# EAGLE design PitotCTRLboard (EAGLE 9.6.2)
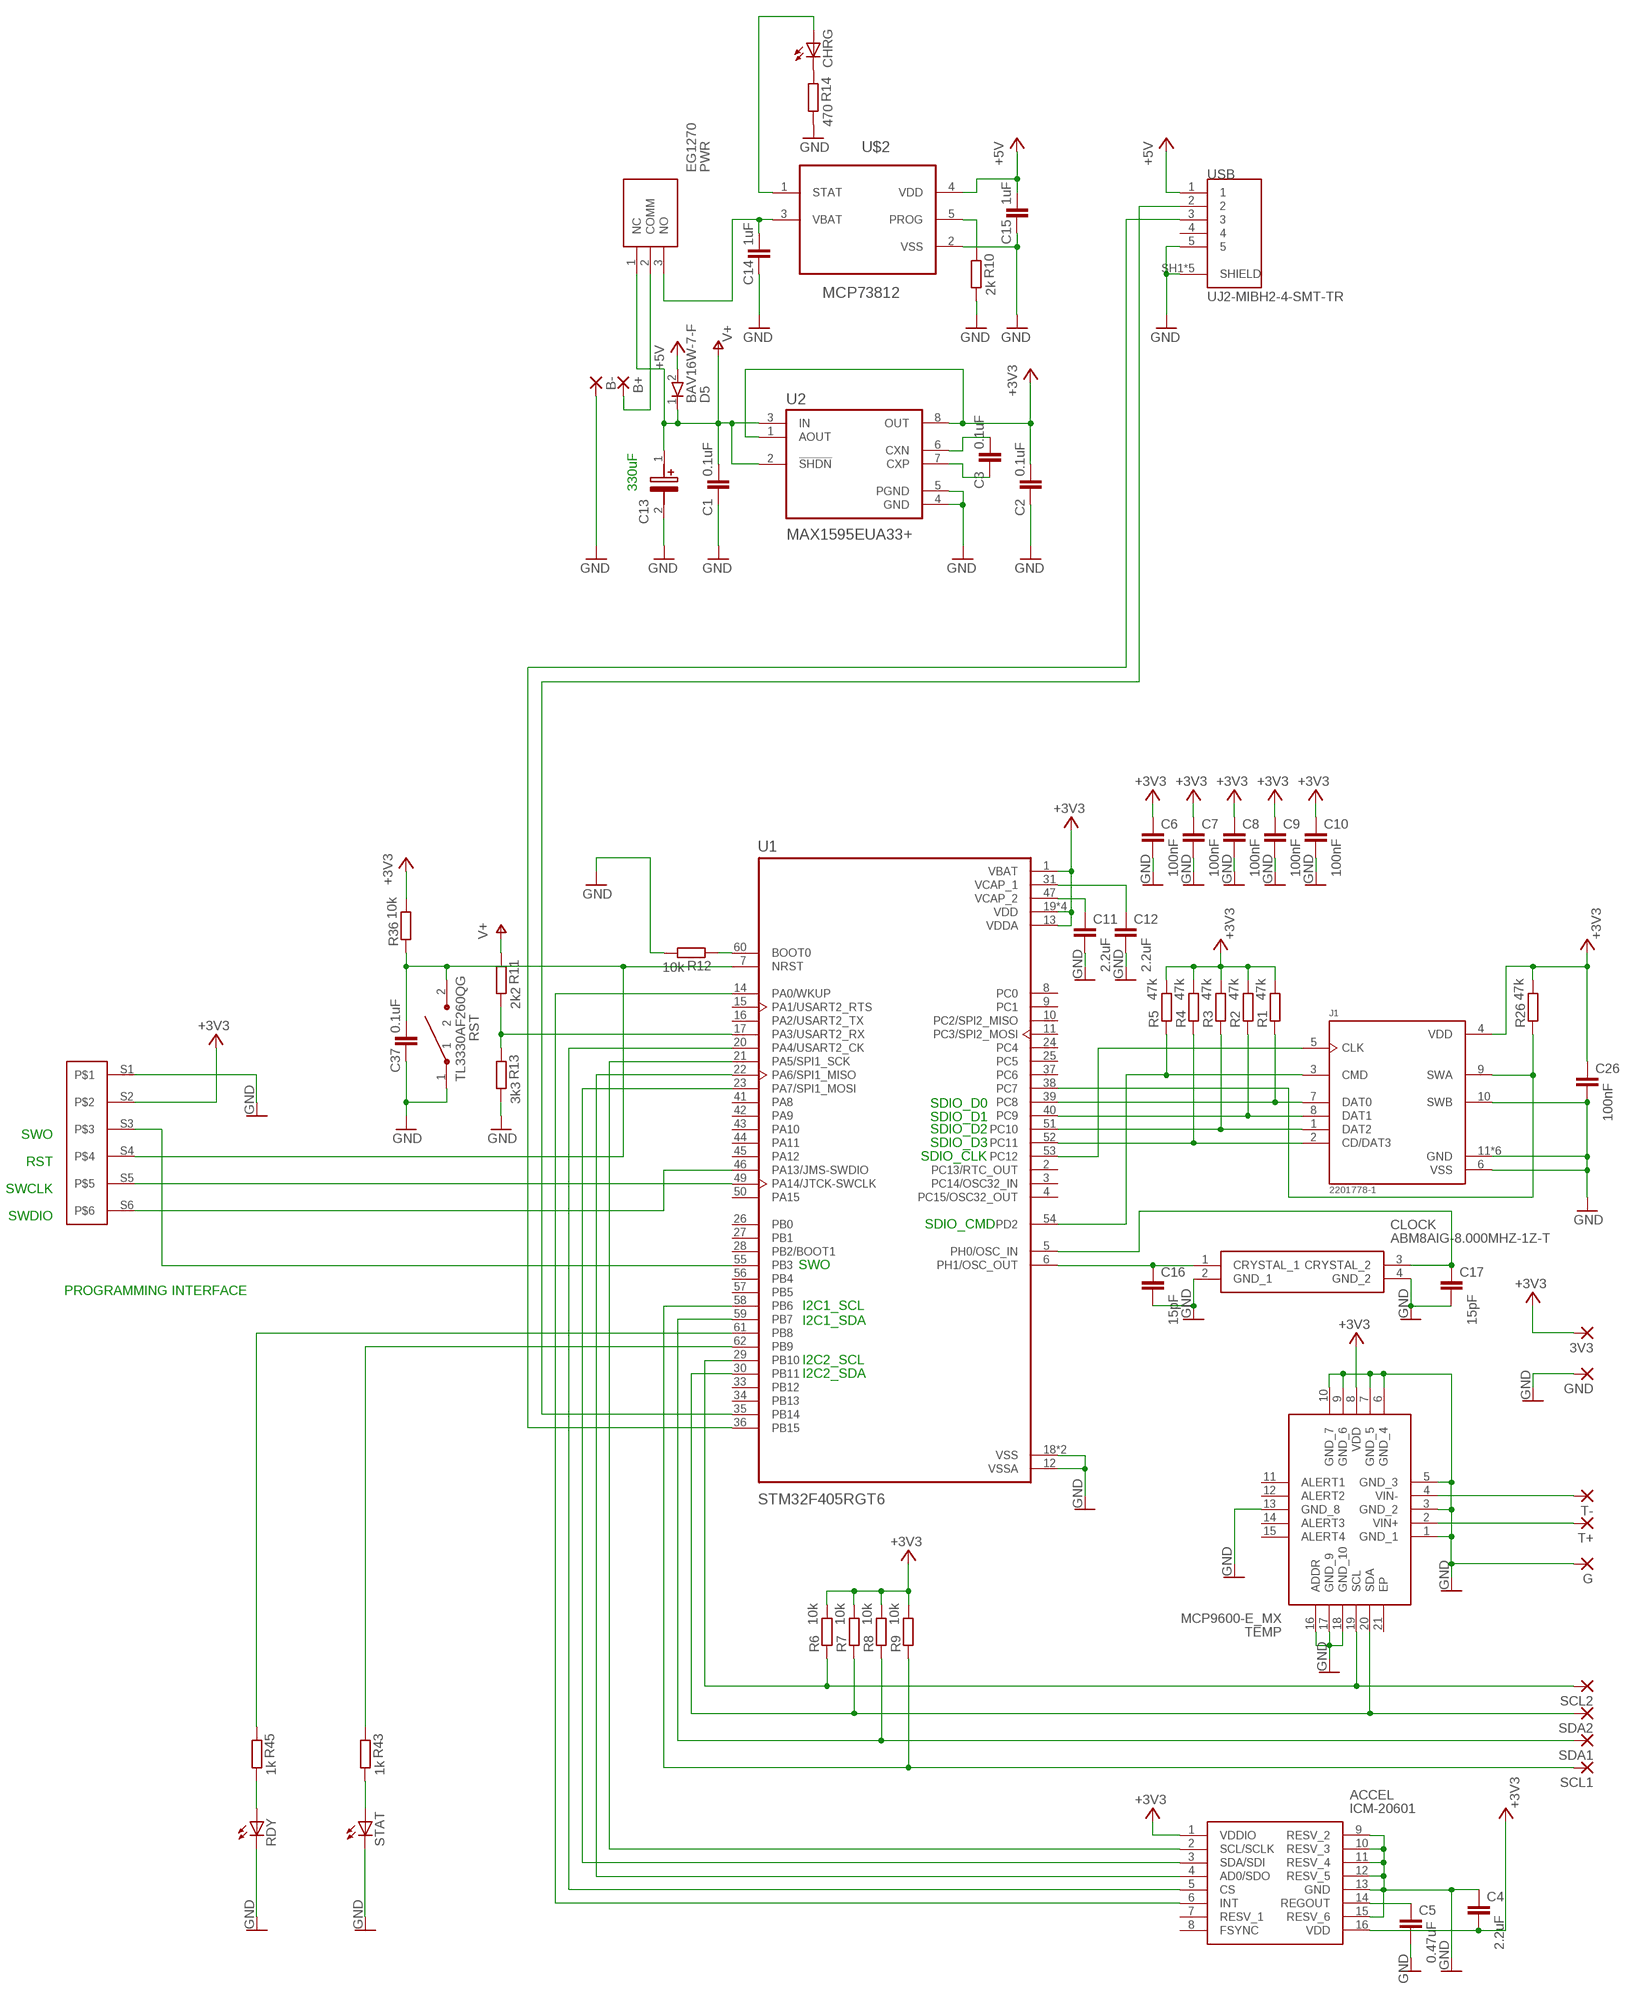
[diagram p0: schematic, sheet 1]

## Parts
3V3  SMD2  [SMD1,27-2,54]
ACCEL  ICM-20601  [PULL-BACK-QFN-16]
B+  1,6/0,9  [1,6/0,9]
B-  1,6/0,9  [1,6/0,9]
C1  0.1uF  C-EUC0603K  [C0603K]
C2  0.1uF  C-EUC0603K  [C0603K]
C3  0.1uF  C-EUC0603K  [C0603K]
C4  2.2uF  C-EUC0603K  [C0603K]
C5  0.47uF  C-EUC0603K  [C0603K]
C6  100nF  C-EUC0603K  [C0603K]
C7  100nF  C-EUC0603K  [C0603K]
C8  100nF  C-EUC0603K  [C0603K]
C9  100nF  C-EUC0603K  [C0603K]
C10  100nF  C-EUC0603K  [C0603K]
C11  2.2uF  C-EUC0603K  [C0603K]
C12  2.2uF  C-EUC0603K  [C0603K]
C13  330uF  T491C106K035AT  [CAPPM6032X280N]
C14  1uF  C-EUC0603K  [C0603K]
C15  1uF  C-EUC0603K  [C0603K]
C16  15pF  C-EUC0603K  [C0603K]
C17  15pF  C-EUC0603K  [C0603K]
C26  100nF  C-EUC0603K  [C0603K]
C37  0.1uF  C-EUC0603K  [C0603K]
CHRG  LEDCHIPLED_0805  [CHIPLED_0805]
CLOCK  ABM8AIG-8.000MHZ-1Z-T  [ABM8AIG8000MHZ1ZT]
D5  BAV16W-7-F  [SOD3716X145N]
G  1,6/0,9  [1,6/0,9]
GND  SMD2  [SMD1,27-2,54]
J1  2201778-1  [TE_2201778-1]
PWR  EG1270  [EG1270]
R1  47k  R-EU_R0603  [R0603]
R2  47k  R-EU_R0603  [R0603]
R3  47k  R-EU_R0603  [R0603]
R4  47k  R-EU_R0603  [R0603]
R5  47k  R-EU_R0603  [R0603]
R6  10k  R-EU_R0603  [R0603]
R7  10k  R-EU_R0603  [R0603]
R8  10k  R-EU_R0603  [R0603]
R9  10k  R-EU_R0603  [R0603]
R10  2k  R-EU_R0603  [R0603]
R11  2k2  R-EU_R0603  [R0603]
R12  10k  R-EU_R0603  [R0603]
R13  3k3  R-EU_R0603  [R0603]
R14  470  R-EU_R0603  [R0603]
R26  47k  R-EU_R0603  [R0603]
R36  10k  R-EU_R0603  [R0603]
R43  1k  R-EU_R0603  [R0603]
R45  1k  R-EU_R0603  [R0603]
RDY  LEDCHIPLED_0805  [CHIPLED_0805]
RST  TL3330AF260QG  [TL3330]
SCL1  1,6/0,9  [1,6/0,9]
SCL2  1,6/0,9  [1,6/0,9]
SDA1  1,6/0,9  [1,6/0,9]
SDA2  1,6/0,9  [1,6/0,9]
STAT  LEDCHIPLED_0805  [CHIPLED_0805]
T+  1,6/0,9  [1,6/0,9]
T-  1,6/0,9  [1,6/0,9]
TEMP  MCP9600-E_MX  [QFN65P500X500X100-21N]
U1  STM32F405RGT6  [QFP50P1200X1200X160-64N]
U2  MAX1595EUA33+  [SOP65P490X110-8N]
U$1  DEBUG  [DEBUG]
U$2  MCP73812  MCP73831T-2ACI/OT  [SOT95P280X145-5N]
USB  UJ2-MIBH2-4-SMT-TR  [CUI_UJ2-MIBH2-4-SMT-TR]

## Nets
+3V3: 3V3.1(P) ACCEL.1(VDDIO) ACCEL.16(VDD) C2.1 C4.2 C6.1 C7.1 C8.1 C9.1 C10.1 C26.1 J1.4(VDD) R1.2 R2.2 R3.2 R4.2 R5.2 R6.2 R7.2 R8.2 R9.2 R26.2 R36.2 TEMP.8(VDD) U1.1(VBAT) U1.13(VDDA) U1.19(VDD) U1.32(VDD) U1.48(VDD) U1.64(VDD) U2.1(AOUT) U2.8(OUT) U$1.S2
+5V: C15.1 D5.2(A) U$2.4(VDD) USB.1
GND: ACCEL.9(RESV_2) ACCEL.10(RESV_3) ACCEL.11(RESV_4) ACCEL.12(RESV_5) ACCEL.13(GND) ACCEL.15(RESV_6) B-.1(P) C1.2 C2.2 C4.1 C5.2 C6.2 C7.2 C8.2 C9.2 C10.2 C11.2 C12.2 C13.2(-) C14.2 C15.2 C16.2 C17.2 C26.2 C37.2 CLOCK.2(GND_1) CLOCK.4(GND_2) G.1(P) GND.1(P) J1.6(VSS) J1.10(SWB) J1.11(GND) J1.12(GND) J1.13(GND) J1.14(GND) J1.15(GND) J1.16(GND) R10.2 R12.2 R13.2 R14.2 RDY.C RST.1 STAT.C TEMP.1(GND_1) TEMP.3(GND_2) TEMP.5(GND_3) TEMP.6(GND_4) TEMP.7(GND_5) TEMP.9(GND_6) TEMP.10(GND_7) TEMP.13(GND_8) TEMP.16(ADDR) TEMP.17(GND_9) TEMP.18(GND_10) U1.12(VSSA) U1.18(VSS) U1.63(VSS) U2.4(GND) U2.5(PGND) U$1.S1 U$2.2(VSS) USB.5 USB.SH1(SHIELD) USB.SH2(SHIELD) USB.SH3(SHIELD) USB.SH4(SHIELD) USB.SH5(SHIELD)
N$1: T-.1(P) TEMP.4(VIN-)
N$2: T+.1(P) TEMP.2(VIN+)
N$3: R8.1 SDA1.1(P) U1.59(PB7)
N$4: R9.1 SCL1.1(P) U1.58(PB6)
N$5: J1.7(DAT0) R1.1 U1.39(PC8)
N$6: J1.8(DAT1) R2.1 U1.40(PC9)
N$7: J1.1(DAT2) R3.1 U1.51(PC10)
N$8: J1.2(CD/DAT3) R4.1 U1.52(PC11)
N$9: J1.3(CMD) R5.1 U1.54(PD2)
N$10: R6.1 SCL2.1(P) TEMP.19(SCL) U1.29(PB10)
N$11: R7.1 SDA2.1(P) TEMP.20(SDA) U1.30(PB11)
N$12: ACCEL.2(SCL/SCLK) U1.21(PA5/SPI1_SCK)
N$13: U1.46(PA13/JMS-SWDIO) U$1.S6
N$14: ACCEL.4(AD0/SDO) U1.22(PA6/SPI1_MISO)
N$15: ACCEL.3(SDA/SDI) U1.23(PA7/SPI1_MOSI)
N$16: U1.49(PA14/JTCK-SWCLK) U$1.S5
N$17: ACCEL.5(CS) U1.20(PA4/USART2_CK)
N$18: J1.5(CLK) U1.53(PC12)
N$19: R12.1 U1.60(BOOT0)
N$20: R43.2 STAT.A
N$21: R43.1 U1.62(PB9)
N$22: R45.1 U1.61(PB8)
N$23: C17.1 CLOCK.3(CRYSTAL_2) U1.5(PH0/OSC_IN)
N$24: B+.1(P) PWR.2(COMM)
N$25: C3.1 U2.6(CXN)
N$26: C3.2 U2.7(CXP)
N$31: ACCEL.14(REGOUT) C5.1
N$32: U1.35(PB14) USB.2
N$33: C12.1 U1.31(VCAP_1)
N$34: C11.1 U1.47(VCAP_2)
N$35: U1.36(PB15) USB.3
N$36: R10.1 U$2.5(PROG)
N$37: R11.2 R13.1 U1.17(PA3/USART2_RX)
N$38: C14.1 PWR.3(NO) U$2.3(VBAT)
N$39: C16.1 CLOCK.1(CRYSTAL_1) U1.6(PH1/OSC_OUT)
N$40: CHRG.A U$2.1(STAT)
N$41: CHRG.C R14.1
N$42: ACCEL.6(INT) U1.14(PA0/WKUP)
N$50: C37.1 R36.1 RST.2 U1.7(NRST) U$1.S4
N$51: R45.2 RDY.A
N$71: J1.9(SWA) R26.1 U1.38(PC7)
N$93: U1.55(PB3) U$1.S3
V+: C1.1 C13.1(+) D5.1(K) PWR.1(NC) R11.1 U2.2(!SHDN) U2.3(IN)
Unconnected: ACCEL.7(RESV_1) ACCEL.8(FSYNC) TEMP.11(ALERT1) TEMP.12(ALERT2) TEMP.14(ALERT3) TEMP.15(ALERT4) TEMP.21(EP) U1.2(PC13/RTC_OUT) U1.3(PC14/OSC32_IN) U1.4(PC15/OSC32_OUT) U1.8(PC0) U1.9(PC1) U1.10(PC2/SPI2_MISO) U1.11(PC3/SPI2_MOSI) U1.15(PA1/USART2_RTS) U1.16(PA2/USART2_TX) U1.24(PC4) U1.25(PC5) U1.26(PB0) U1.27(PB1) U1.28(PB2/BOOT1) U1.33(PB12) U1.34(PB13) U1.37(PC6) U1.41(PA8) U1.42(PA9) U1.43(PA10) U1.44(PA11) U1.45(PA12) U1.50(PA15) U1.56(PB4) U1.57(PB5) USB.4

## Notes on the sheet
- 330uF
- SDIO_D0
- SDIO_D1
- SWO
- SDIO_D2
- SDIO_D3
- RST
- SDIO_CLK
- SWCLK
- SWDIO
- SDIO_CMD
- SWO
- PROGRAMMING INTERFACE
- I2C1_SCL
- I2C1_SDA
- I2C2_SCL
- I2C2_SDA

## Library data of the parts
3V3 GND = wirepad:SMD2: SMD PAD
ACCEL = ICM-20601:ICM-20601: IMU ACCEL/GYRO/TEMP I2C/SPI LGA Source: Datasheet <http://www.invensense.com/wp-content/uploads/2015/12/DS-000191-ICM-20601-v1.0.pdf>; DESCRIPTION: IMU ACCEL/GYRO/TEMP I2C/SPI LGA; HEIGHT: mm; MANUFACTURER_NAME: InvenSense Inc.; MANUFACTURER_PART_NUMBER: ICM-20601; MOUSER_PART_NUMBER: 410-ICM-20601; MOUSER_PRICE-STOCK: https://www.mouser.com/Search/Refine.aspx?Keyword=410-ICM-20601
B+ B- G SCL1 SCL2 SDA1 SDA2 T+ T- = wirepad:1,6/0,9: THROUGH-HOLE PAD
C1-C12 C14-C17 C26 C37 = rcl:C-EU: CAPACITOR, European symbol; SPICEPREFIX: C
C13 = T491C106K035AT:T491C106K035AT: KEMET 10uF 35V dc Tantalum Capacitor MnO2 Solid +/-10% Tolerance T491 Series Source: Datasheet <https://content.kemet.com/datasheets/KEM_T2005_T491.pdf>; ALLIED_NUMBER: 70610893; ALLIED_PRICE-STOCK: https://www.alliedelec.com/kemet-t491c106k035at/70610893/; DESCRIPTION: KEMET 10uF 35V dc Tantalum Capacitor MnO2 Solid +/-10% Tolerance T491 Series; HEIGHT: 2.8mm; MANUFACTURER_NAME: Kemet; MANUFACTURER_PART_NUMBER: T491C106K035AT; MOUSER_PART_NUMBER: 80-T491C106K035; MOUSER_PRICE-STOCK: https://www.mouser.com/Search/Refine.aspx?Keyword=80-T491C106K035; RS_PART_NUMBER: 8015520; RS_PRICE-STOCK: https://uk.rs-online.com/web/p/products/8015520
CHRG RDY STAT = led:LED: LED OSRAM: - CHIPLED LG R971, LG N971, LY N971, LG Q971, LY Q971, LO R971, LY R971 LH N974, LH R974 LS Q976, LO Q976, LY Q976 LO Q996 - Hyper CHIPLED LW Q18S LB Q993, LB Q99A, LB R99A - SideLED LS A670, LO A670, LY A670, LG A670, LP A670 LB A673, LV A673, LT A673, LW A673 LH A674 LY A675 LS A676, LA A676, LO A676, LY A676, LW A676 LS A679, LY A679, LG A679 - Hyper Micro SIDELED® LS Y876, LA Y876, LO Y876, LY Y876 LT Y87S - SmartLED LW L88C, LW L88S LB L89C, LB L89S, LG L890 LS L89K, LO L89K, LY L89K LS L896, LA L896, LO L896, LY L896 - TOPLED LS T670, LO T670, LY T670, LG T670, LP T670 LSG T670, LSP T670, LSY T670, LOP T670, LYG T670 LG T671, LOG T671, LSG T671 LB T673, LV T673, LT T673, LW T673 LH T674 LS T676, LA T676, LO T676, LY T676, LB T676, LH T676, LSB T676, LW T676 LB T67C, LV T67C, LT T67C, LS T67K, LO T67K, LY T67K, LW E67C LS E67B, LA E67B, LO E67B, LY E67B, LB E67C, LV E67C, LT E67C LW T67C LS T679, LY T679, LG T679 LS T770, LO T770, LY T770, LG T770, LP T770 LB T773, LV T773, LT T773, LW T773 LH T774 LS E675, LA E675, LY E675, LS T675 LS T776, LA T776, LO T776, LY T776, LB T776 LHGB T686 LT T68C, LB T68C - Hyper Mini TOPLED® LB M676 - Mini TOPLED Santana® LG M470 LS M47K, LO M47K, LY M47K Source: http://www.osram.convergy.de LUXEON: - LUMILED® LXK2-PW12-R00, LXK2-PW12-S00, LXK2-PW14-U00, LXK2-PW14-V00 LXK2-PM12-R00, LXK2-PM12-S00, LXK2-PM14-U00 LXK2-PE12-Q00, LXK2-PE12-R00, LXK2-PE12-S00, LXK2-PE14-T00, LXK2-PE14-U00 LXK2-PB12-K00, LXK2-PB12-L00, LXK2-PB12-M00, LXK2-PB14-N00, LXK2-PB14-P00, LXK2-PB14-Q00 LXK2-PR12-L00, LXK2-PR12-M00, LXK2-PR14-Q00, LXK2-PR14-R00 LXK2-PD12-Q00, LXK2-PD12-R00, LXK2-PD12-S00 LXK2-PH12-R00, LXK2-PH12-S00 LXK2-PL12-P00, LXK2-PL12-Q00, LXK2-PL12-R00 Source: www.luxeon.com KINGBRIGHT: KA-3528ASYC Source: www.kingbright.com
CLOCK = ABM8AIG-8.000MHZ-1Z-T:ABM8AIG-8.000MHZ-1Z-T: Crystals 18pF 8MHz 10ppm AEC-Q200 -40C +125C Source: Datasheet <https://abracon.com/AIGcrystals/ABM8AIG.pdf>; DESCRIPTION: Crystals 18pF 8MHz 10ppm AEC-Q200 -40C +125C; HEIGHT: 0.8mm; MANUFACTURER_NAME: ABRACON; MANUFACTURER_PART_NUMBER: ABM8AIG-8.000MHZ-1Z-T; MOUSER_PART_NUMBER: 815-M8AIG-8-1ZT; MOUSER_PRICE-STOCK: https://www.mouser.com/Search/Refine.aspx?Keyword=815-M8AIG-8-1ZT
D5 = BAV16W-7-F:BAV16W-7-F: Diode Switching 100V 0.15A 2Pin SOD123 Diodes Inc BAV16W-7-F Switching Diode, 300mA 100V, 2-Pin SOD-123 Source: Datasheet <http://docs-emea.rs-online.com/webdocs/104c/0900766b8104c76b.pdf>; ALLIED_NUMBER: 70437641; ALLIED_PRICE-STOCK: http://www.alliedelec.com/diodes-inc-bav16w-7-f/70437641/; DESCRIPTION: Diode Switching 100V 0.15A 2Pin SOD123 Diodes Inc BAV16W-7-F Switching Diode, 300mA 100V, 2-Pin SOD-123; HEIGHT: 1.45mm; MANUFACTURER_NAME: Diodes Inc.; MANUFACTURER_PART_NUMBER: BAV16W-7-F; MOUSER_PART_NUMBER: 621-BAV16W-F; MOUSER_PRICE-STOCK: https://www.mouser.com/Search/Refine.aspx?Keyword=621-BAV16W-F; RS_PART_NUMBER: 7513430P; RS_PRICE-STOCK: http://uk.rs-online.com/web/p/products/7513430P
J1 = 2201778-1:2201778-1: MICRO SD PUSH PUSH LOW PROFILE TYPE; MANUFACTURER: TE Connectivity; PARTREV: B; STANDARD: Manufacturer recommendations
PWR = EG1270:EG1270: E-SWITCH - EG1270 - SWITCH, SLIDE, SPDT, 300mA, 6V, PCB Source: Datasheet <https://componentsearchengine.com/Datasheets/1/EG1270.pdf>; ARROW_PART_NUMBER: EG1270; DESCRIPTION: E-SWITCH - EG1270 - SWITCH, SLIDE, SPDT, 300mA, 6V, PCB; HEIGHT: 4.6mm; MANUFACTURER_NAME: E-Switch; MANUFACTURER_PART_NUMBER: EG1270; MOUSER_PART_NUMBER: 612-EG1270; MOUSER_PRICE-STOCK: https://www.mouser.co.uk/ProductDetail/E-Switch/EG1270?qs=xDsBkp9LkodMM2ilVTltow%3D%3D
R1-R14 R26 R36 R43 R45 = rcl:R-EU_: RESISTOR, European symbol; SPICEPREFIX: R
RST = TL3330AF260QG:TL3330AF260QG: Tactile Switches 50mA@12VDC 260g OF Silver contacts Source: Datasheet <https://www.e-switch.com/system/asset/product_line/data_sheet/163/TL3330.pdf>; DESCRIPTION: Tactile Switches 50mA@12VDC 260g OF Silver contacts; HEIGHT: mm; MANUFACTURER_NAME: E-Switch; MANUFACTURER_PART_NUMBER: TL3330AF260QG; MOUSER_PART_NUMBER: 612-TL3330AF260QG; MOUSER_PRICE-STOCK: https://www.mouser.co.uk/ProductDetail/E-Switch/TL3330AF260QG?qs=cyOInwlKnROnXHK5BnOqnQ%3D%3D
TEMP = MCP9600-E_MX:MCP9600-E_MX: Board Mount Temperature Sensors Thermocouple to I2C converter Source: Datasheet <http://ww1.microchip.com/downloads/en/DeviceDoc/MCP9600-Data-Sheet-DS20005426D.pdf>; DESCRIPTION: Board Mount Temperature Sensors Thermocouple to I2C converter; HEIGHT: 1mm; MANUFACTURER_NAME: Microchip; MANUFACTURER_PART_NUMBER: MCP9600-E/MX; MOUSER_PART_NUMBER: 579-MCP9600-E/MX; MOUSER_PRICE-STOCK: https://www.mouser.com/Search/Refine.aspx?Keyword=579-MCP9600-E%2FMX; RS_PART_NUMBER: 1717832P; RS_PRICE-STOCK: http://uk.rs-online.com/web/p/products/1717832P
U1 = STM32F405RGT6:STM32F405RGT6: High-performance foundation line, ARM Cortex-M4 core with DSP and FPU, 1 Mbyte Flash, 168 MHz CPU, ART Accelerator; AVAILABILITY: Unavailable; DESCRIPTION: ARM® Cortex®-M4 STM32F4 Microcontroller IC 32-Bit 168MHz 1MB (1M x 8) FLASH 64-LQFP (10x10); MF: STMicroelectronics; MP: STM32F405RGT6; PACKAGE: LQFP-64 STMicroelectronics; PRICE: None
U2 = MAX1595EUA33_:MAX1595EUA33+: None; AVAILABILITY: Unavailable; DESCRIPTION: Charge Pump Switching Regulator IC Positive Fixed 3.3V 1 Output 125mA 8-TSSOP, 8-MSOP (0.118, 3.00mm Width); MF: Maxim Integrated; MP: MAX1595EUA33; PACKAGE: None; PRICE: None
U$1 = DEBUG:DEBUG
U$2 = MCP73831T-2ACI_OT:MCP73831T-2ACI/OT: Charge Management Controller Buy Part <https://snapeda.com/parts/MCP73831T-2ACI/OT/Microchip/view-part/?ref=eda>; AVAILABILITY: Warning; DESCRIPTION: Charger IC Lithium Ion/Polymer SOT-23-5; DIGIKEY-PURCHASE-URL: https://snapeda.com/shop?store=DigiKey&id=53208; MF: Microchip; MOUSER-PURCHASE-URL: https://snapeda.com/shop?store=Mouser&id=53208; MP: MCP73831T-2ACI/OT; PACKAGE: SOT-23 Microchip; PRICE: None
USB = UJ2-MIBH2-4-SMT-TR:UJ2-MIBH2-4-SMT-TR: Micro B Type 5 Pin Horizontal 30 µin Plating SMT USB Jack 2.0 Buy Part <https://snapeda.com/parts/UJ2-MIBH2-4-SMT-TR/CUI%20Devices/view-part/?ref=eda>; AVAILABILITY: Warning; CUI_PURCHASE_URL: https://www.cuidevices.com/product/interconnect/connectors/usb-connectors/uj2-mibh2-4-smt?utm_source=snapeda.com&utm_medium=referral&utm_campaign=snapedaBOM; DESCRIPTION: Micro B, USB 2.0, 1.8 A, Right Angle, Surface Mount (SMT), USB Receptacle; DIGIKEY-PURCHASE-URL: https://snapeda.com/shop?store=DigiKey&id=702231; MF: CUI Devices; MOUSER-PURCHASE-URL: https://snapeda.com/shop?store=Mouser&id=702231; MP: UJ2-MIBH2-4-SMT-TR; PACKAGE: None; PRICE: None

## Board
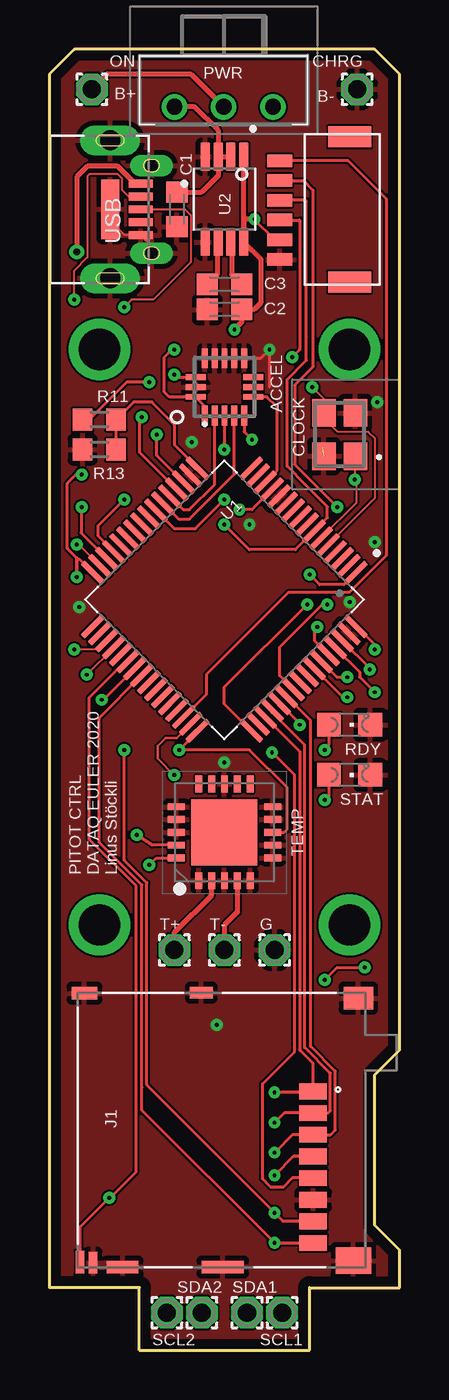
[diagram p1: board, top side]
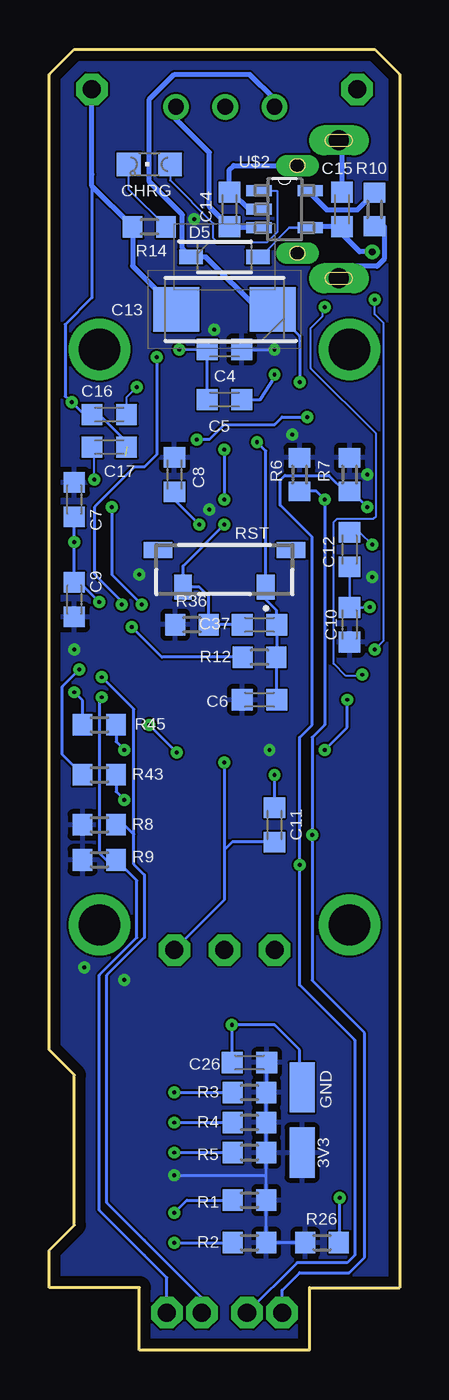
[diagram p2: board, bottom side, seen from below]

Size 17.78 x 66.04 mm. Coordinates in mm from the lower left corner, seen from the top.
Outline: 4.57,0 13.21,0 13.21,3.18 17.78,3.18 17.78,5.08 16.51,6.35 16.51,13.97 17.78,15.24 17.78,64.77 16.51,66.04 1.27,66.04 0,64.77 0,3.18 4.57,3.18 4.57,0
Copper layers (1*16): Top 0.035mm / dielectric 1.5mm / Bottom 0.035mm
Design rules "default *": minimum track width 4mil, minimum drill 0.2mm, track to track 4mil, track to pad 4mil, pad to pad 4mil, via to via 4mil, smd to smd 4mil, copper to edge 20mil, drill to drill 4mil, minimum pad ring 4mil, minimum via ring 8mil, stop-mask expansion 4mil, vias tented up to drill 0mil, thermal gap 10mil

### Footprints (pad centres in the part's own frame; a part is rotated, then mirrored left to right if it is on the bottom)
SMD1,27-2,54 = smd 1.27 x 2.54: 1 0,0
PULL-BACK-QFN-16 = smd 1.008 x 0.3: 1 -1.454,1; 2 -1.454,0.5; 3 -1.454,0; 4 -1.454,-0.5; 5 -1.454,-1; 9 1.454,-1; 10 1.454,-0.5; 11 1.454,0; 12 1.454,0.5; 13 1.454,1 | smd 0.3 x 1.008: 6 -0.5,-1.454; 7 0,-1.454; 8 0.5,-1.454; 14 0.5,1.454; 15 0,1.454; 16 -0.5,1.454
1,6/0,9 = drill 0.914 pad 1.6 octagon: 1 0,0
C0603K = smd 1.05 x 1.08: 1 -0.875,0; 2 0.875,0
CAPPM6032X280N = smd 2.35 x 2.25: 1 -2.45,0; 2 2.45,0
CHIPLED_0805 = smd 1.2 x 1.2: A 0,-1.05; C 0,1.05
ABM8AIG8000MHZ1ZT = smd 1.4 x 1.2: 1 -1.1,-0.8; 2 1.1,-0.8; 3 1.1,0.8; 4 -1.1,0.8
SOD3716X145N = smd 1.2 x 0.75: 1 -1.7,0; 2 1.7,0
TE_2201778-1 = smd 0.8 x 1.4: 1 1.965,-4.75; 2 0.865,-4.75; 3 -0.235,-4.75; 4 -1.335,-4.75; 5 -2.435,-4.75; 6 -3.535,-4.75; 7 -4.635,-4.75; 8 -5.735,-4.75 | smd 1.15 x 0.45: 9 -6.7,7.075 | smd 1.1 x 0.45: 10 -6.725,6.415 | smd 1.35 x 1.8: 11 -6.625,-6.8 | smd 0.65 x 2.14: 12 -6.95,-0.17 | smd 0.65 x 1.6: 13 -6.95,4.91 | smd 0.65 x 1.3: 14 6.95,6.85 | smd 0.6 x 1.15: 15 6.975,0.925 | smd 1.16 x 1.5: 16 6.695,-7.05
EG1270 = drill 0.8 pad 1.3: 1 0,0; 2 0,2.5; 3 0,5
R0603 = smd 1 x 1.1: 1 -0.85,0; 2 0.85,0
TL3330 = smd 0.9 x 1.27: 1 -2.1,0.885; 2 2.1,0.885 | smd 1.45 x 0.8: 3 -3.375,-1; 4 3.375,-1
QFN65P500X500X100-21N = smd 0.85 x 0.35: 1 -2.45,1.3; 2 -2.45,0.65; 3 -2.45,0; 4 -2.45,-0.65; 5 -2.45,-1.3; 11 2.45,-1.3; 12 2.45,-0.65; 13 2.45,0; 14 2.45,0.65; 15 2.45,1.3 | smd 0.35 x 0.85: 6 -1.3,-2.45; 7 -0.65,-2.45; 8 0,-2.45; 9 0.65,-2.45; 10 1.3,-2.45; 16 1.3,2.45; 17 0.65,2.45; 18 0,2.45; 19 -0.65,2.45; 20 -1.3,2.45 | smd 3.35 x 3.35: 21 0,0
QFP50P1200X1200X160-64N = smd 1.47 x 0.28: 1 -5.67,3.75; 2 -5.67,3.25; 3 -5.67,2.75; 4 -5.67,2.25; 5 -5.67,1.75; 6 -5.67,1.25; 7 -5.67,0.75; 8 -5.67,0.25; 9 -5.67,-0.25; 10 -5.67,-0.75; 11 -5.67,-1.25; 12 -5.67,-1.75; 13 -5.67,-2.25; 14 -5.67,-2.75; 15 -5.67,-3.25; 16 -5.67,-3.75; 33 5.67,-3.75; 34 5.67,-3.25; 35 5.67,-2.75; 36 5.67,-2.25; 37 5.67,-1.75; 38 5.67,-1.25; 39 5.67,-0.75; 40 5.67,-0.25; 41 5.67,0.25; 42 5.67,0.75; 43 5.67,1.25; 44 5.67,1.75; 45 5.67,2.25; 46 5.67,2.75; 47 5.67,3.25; 48 5.67,3.75 | smd 0.28 x 1.47: 17 -3.75,-5.67; 18 -3.25,-5.67; 19 -2.75,-5.67; 20 -2.25,-5.67; 21 -1.75,-5.67; 22 -1.25,-5.67; 23 -0.75,-5.67; 24 -0.25,-5.67; 25 0.25,-5.67; 26 0.75,-5.67; 27 1.25,-5.67; 28 1.75,-5.67; 29 2.25,-5.67; 30 2.75,-5.67; 31 3.25,-5.67; 32 3.75,-5.67; 49 3.75,5.67; 50 3.25,5.67; 51 2.75,5.67; 52 2.25,5.67; 53 1.75,5.67; 54 1.25,5.67; 55 0.75,5.67; 56 0.25,5.67; 57 -0.25,5.67; 58 -0.75,5.67; 59 -1.25,5.67; 60 -1.75,5.67; 61 -2.25,5.67; 62 -2.75,5.67; 63 -3.25,5.67; 64 -3.75,5.67
SOP65P490X110-8N = smd 1.42 x 0.47: 1 -2.165,0.975; 2 -2.165,0.325; 3 -2.165,-0.325; 4 -2.165,-0.975; 5 2.165,-0.975; 6 2.165,-0.325; 7 2.165,0.325; 8 2.165,0.975
DEBUG = smd 2.184 x 1.067: P7 0.254,3.683; P9 0.254,-3.683 | smd 1.27 x 0.635: S1 3.81,2.54; S2 3.81,1.54; S3 3.81,0.54; S4 3.81,-0.46; S5 3.81,-1.46; S6 3.81,-2.46
SOT95P280X145-5N = smd 1.27 x 0.559: 1 -1.295,0.94; 2 -1.295,0; 3 -1.295,-0.94; 4 1.295,-0.94; 5 1.295,0.94
CUI_UJ2-MIBH2-4-SMT-TR = smd 0.4 x 1.2: 1 -1.3,2.1; 2 -0.65,2.1; 3 0,2.1; 4 0.65,2.1; 5 1.3,2.1 | drill 1.016 pad 1.2 long: SH1 -3.5,0.55; SH4 3.5,0.55 | drill 0.65 pad 1.1 long: SH2 -2.225,2.65; SH3 2.225,2.65 | smd 3 x 0.9: SH5 0,0.55

### Placement (x,y rotation side)
3V3  4.95,10.03 0 bottom
ACCEL  8.89,48.9 90 top
B+  2.16,64.01 270 top
B-  15.62,64.01 90 top
C1  6.48,57.91 270 top
C2  8.89,52.83 180 top
C3  8.89,54.1 0 top
C4  8.89,50.8 0 bottom
C5  8.89,48.26 180 bottom
C6  7.11,33.02 0 bottom
C7  16.51,43.18 270 bottom
C8  11.43,44.45 270 bottom
C9  16.51,38.1 90 bottom
C10  2.54,36.83 90 bottom
C11  6.35,26.67 270 bottom
C12  2.54,40.64 270 bottom
C13  8.89,52.83 180 bottom
C14  8.64,57.91 90 bottom
C15  2.92,57.91 90 bottom
C16  14.73,45.85 0 bottom
C17  14.73,47.5 180 bottom
C26  7.62,14.61 180 bottom
C37  7.11,36.83 0 bottom
CHRG  12.7,60.2 90 bottom
CLOCK  14.73,46.48 90 top
D5  8.89,55.5 0 bottom
G  11.43,20.32 0 top
GND  4.95,13.34 0 bottom
J1  8.64,11.18 90 top
PWR  6.35,63.12 270 top
R1  7.62,7.62 0 bottom
R2  7.62,5.46 0 bottom
R3  7.62,13.08 0 bottom
R4  7.62,11.56 0 bottom
R5  7.62,10.03 0 bottom
R6  5.08,44.45 90 bottom
R7  2.54,44.45 90 bottom
R8  15.24,26.67 180 bottom
R9  15.24,24.89 180 bottom
R10  1.27,57.91 270 bottom
R11  2.54,47.24 0 top
R12  7.11,35.18 0 bottom
R13  2.54,45.72 180 top
R14  12.7,57.02 180 bottom
R26  3.94,5.46 180 bottom
R36  10.54,36.83 180 bottom
R43  15.24,29.21 0 bottom
R45  15.24,31.75 0 bottom
RDY  15.24,31.75 270 top
RST  8.89,39.62 180 bottom
SCL1  11.81,1.91 0 top
SCL2  5.97,1.91 0 top
SDA1  10.03,1.91 0 top
SDA2  7.75,1.91 0 top
STAT  15.24,29.21 270 top
T+  6.35,20.32 0 top
T-  8.89,20.32 0 top
TEMP  8.89,26.29 90 top
U1  8.89,38.1 225 top
U2  8.89,58.42 270 top
U$1  15.49,57.91 180 top
U$2  5.84,57.91 0 bottom
USB  2.54,57.91 270 top

### Tracks (layer width: path | path; a pad name or v marks a point on that pad's centre or on a via)
+3V3  (via drill 0.2)
  Top 0.15: v1.4,39.24 1.4,40.22 0.92,40.7 0.92,44.01 1.35,44.45 v1.65,44.45 | v13.97,18.8 14.61,19.43 v16,19.43
  Top 0.152: J1.4 12.38,9.84 v11.43,8.89 | ACCEL.16 7.43,48.39 | 7.43,48.39 6.1,48.39 5.84,48.64 5.84,50.42 6.22,50.8 v6.35,50.8 | ACCEL.1 7.89,47.92 7.43,48.39 | U$1.S2 11.43,56.37 10.41,57.39 v10.41,57.4 | U1.1 14.96,38.86 13.72,38.86 v13.21,39.37 | TEMP.8 11.92,26.29 12.07,26.44 12.07,28.57 10.16,30.48 v6.6,30.48 7.53,31.41 U1.48 | U1.13 10.28,42.67 v9.65,42.67 | U1.64 15.58,36.74 16.51,35.81 v16.51,35.56 | U1.19 5.46,45.42 v5.46,46.48 | U1.32 1.56,40.13 1.4,40.13 v1.4,39.24
  Top 0.254: U2.8 U2.1 | U2.8 10.72,55.4 10.72,53.15 10.4,52.83 C2.1 9.77,52.18 v9.4,51.82 | v10.41,57.4 9.87,57.4 U2.8
  Bottom 0.152: R26.2 R2.2 R1.2 6.77,8.89 | 6.77,8.89 R5.2 R4.2 R3.2 6.75,13.11 C26.1 | v11.43,8.89 6.77,8.89 | C4.2 v6.35,50.8
  pour Bottom: -8.86,-3.81 -3.77,69.09 21.46,69.09 21.46,-1.4 19.05,-3.81
+5V  (via drill 0.35)
  Top 0.254: USB.1 4.37,59.21 3.49,60.1 1.93,60.1 1.4,59.56 v1.4,55.75
  Bottom 0.127: D5.2 7.07,55.5 5.59,56.97 U$2.4
  Bottom 0.254: v1.4,55.75 2.03,55.75 2.79,56.52 2.79,56.91 C15.1 4.48,57.04 U$2.4
GND  (via drill 0.2)  (1 unrouted)
  Top 0.102: USB.5 3.84,56.61 3.09,57.36 USB.SH5
  Top 0.15: USB.5 5.19,56.06 USB.SH3
  Top 0.152: U2.5 7.92,56.21 | 11.18,48.9 v11.18,50.8 10.73,50.35 ACCEL.9 ACCEL.10 ACCEL.11 ACCEL.12 ACCEL.13
  Bottom 0.127: C12.2 C10.2 1.54,37.7 v1.52,37.72
  Bottom 0.15: C16.2 13.86,46.1 15.25,47.5 C17.2 16,47.5 v16.64,48.13 16.68,48.13 16.98,48.43 16.98,52.07 15.62,53.42 15.62,59.69
  Bottom 0.152: C4.1 10.16,50.8 | 10.16,50.8 v11.18,50.8 | v8.89,29.84 8.89,25.4 | 8.89,25.4 8.89,22.86 G.1 | v7.24,46.1 6.79,45.65 RST.1 6.79,38.1 6.24,37.55 C37.2 6.24,35.2 R12.2 6.24,35.15 C6.2 | C26.2 8.5,16.5 v8.51,16.51 6.35,16.51 5.08,15.24 5.08,13.46 GND.1 | C5.2 9.77,50.41 10.16,50.8 | C11.2 8.5,25.8 8.89,25.4 | v15.24,37.97 16.24,38.98 C9.2 v16.51,41.02 C7.2 | C8.2 11.43,43.18 v10.16,41.91
  Bottom 0.254: C13.2 13.55,55.04 R14.2 15.62,59.09 15.62,59.69 B-.1 | C15.2 2.92,61.24 USB.SH1 | R10.2 0.79,57.06 0.79,55.38 1.15,55.02 2.48,55.02 USB.SH4 | U$2.2 7.63,57.91 8.51,58.79 C14.2 8.64,59.93 8.43,60.14 USB.SH2
  pour Top: -5.08,-2.54 -5.08,66.04 0,71.12 19.05,71.12 22.86,67.31 22.86,0 19.05,-3.81 -3.81,-3.81
N$1
  Top 0.254: TEMP.4 9.54,22.24 8.89,21.59 T-.1
N$2
  Top 0.254: T+.1 6.35,21.21 8.24,23.1 TEMP.2
N$3  (via drill 0.2)
  Top 0.152: U1.59 14.6,34.16 v15.11,34.16
  Bottom 0.15: 12.95,20.96 14.86,19.05 14.86,7.49 12.95,5.59
  Bottom 0.152: 12.95,20.96 12.95,24.13 13.49,24.66 13.49,26.19 | 12.95,5.59 10.03,2.67 SDA1.1 | 13.49,26.19 13.49,32.54 v15.11,34.16 | 13.49,26.19 13.97,26.67 R8.1
N$4  (via drill 0.2)
  Top 0.152: U1.58 14.9,33.15 v15.11,33.15
  Bottom 0.15: 12.95,4.83 15.24,7.11 15.24,19.05 13.34,20.96
  Bottom 0.152: 13.34,20.96 13.34,23.84 R9.1 14.9,24.89 15.24,25.23 15.24,32.89 15.11,33.02 v15.11,33.15 | 12.95,4.83 11.81,3.68 SCL1.1
N$5  (via drill 0.2)
  Top 0.152: J1.7 11.86,6.54 11.43,6.97 v11.43,6.99 4.95,13.46 4.95,23.73 3.81,24.87 v3.81,30.48 | U1.39 2.75,33.02 v2.67,33.02
  Bottom 0.152: v11.43,6.99 10.79,7.62 R1.1 | v3.81,30.48 2.67,31.62 v2.67,33.02
N$6  (via drill 0.2)
  Top 0.152: J1.8 11.45,5.44 v11.43,5.46 4.7,12.19 4.7,13.34 4.7,13.35 4.7,23.62 2.54,25.78 2.54,32.1 U1.40
  Bottom 0.152: v11.43,5.46 R2.1
N$7  (via drill 0.2)
  Top 0.152: v11.43,13.08 13.33,13.08 J1.1 13.39,14.55 12.7,15.24 12.7,30.4 U1.51
  Bottom 0.152: v11.43,13.08 R3.1
N$8  (via drill 0.2)
  Top 0.152: v11.43,11.56 11.91,12.04 J1.2 14.14,12.04 14.26,12.16 14.26,14.06 12.95,15.37 12.95,30.73 11.31,32.37 U1.52
  Bottom 0.152: v11.43,11.56 R4.1
N$9  (via drill 0.2)
  Top 0.152: v11.43,10.03 12.34,10.94 J1.3 14.27,10.94 14.52,11.19 14.52,14.16 13.26,15.42 13.26,31.96 U1.54
  Bottom 0.152: R5.1 v11.43,10.03
N$10  (via drill 0.2)
  Top 0.152: U1.29 2.48,41.33 2.48,41.85 v3.81,43.18 | TEMP.19 5.22,25.64 v4.45,26.16
  Bottom 0.152: R6.1 4.23,43.6 v3.81,43.18 3.81,31.75 4.45,31.12 v4.45,26.16 4.45,18.77 1.78,16.11 1.78,4.72 2.56,3.94 5.08,3.94 5.97,3.05 SCL2.1
N$11  (via drill 0.2)
  Top 0.152: U1.30 1.62,41.49 1.62,42.77 v1.65,42.8 | v5.08,24.64 5.43,24.99 TEMP.20
  Bottom 0.152: v1.65,42.8 2.45,43.6 R7.1 2.79,43.6 3.59,44.41 5.83,44.41 6.06,44.17 6.06,42.9 4.45,41.28 4.45,31.75 5.08,31.12 v5.08,24.64 5.08,18.54 2.29,15.75 2.29,4.83 2.67,4.45 5.21,4.45 SDA2.1
N$12
  Top 0.152: U1.21 6.8,42.66 7.1,42.66 8.39,43.95 ACCEL.2
N$13
  Top 0.152: U1.46 7.97,33.29 7.97,34.3 12.14,38.48 15.24,38.48 17.12,40.36 17.12,58.42 15.17,60.37 U$1.S6
N$14
  Top 0.152: U1.22 6.58,42.18 7.11,42.18 9.39,44.46 ACCEL.4
N$15  (via drill 0.2)
  Top 0.152: ACCEL.3 v8.89,45.72 | U1.23 6.35,41.7 7.41,41.7 v8.89,43.18
  Bottom 0.152: v8.89,45.72 v8.89,43.18
N$16  (via drill 0.2)
  Top 0.15: 13.38,49.91 12.45,48.98 12.45,44.96
  Top 0.152: U$1.S5 12.9,59.37 13.38,58.9 13.38,49.91 | 12.45,44.96 v14.61,42.8 | U1.49 8.89,32.8 8.89,33.66 v13.08,37.85
  Bottom 0.152: v14.61,42.8 14.61,39.37 v13.08,37.85
N$17  (via drill 0.2)
  Top 0.152: ACCEL.5 9.89,46.62 v10.29,46.23 | U1.20 4.57,45.6 4.57,47.24 v4.7,47.37
  Bottom 0.152: v10.29,46.23 9.65,46.23 8.89,46.99 6.35,46.99 5.97,47.37 v4.7,47.37
N$18  (via drill 0.2)
  Top 0.152: J1.5 12.34,8.74 11.88,8.28 11.23,8.28 10.82,8.69 10.82,13.53 12.45,15.16 12.45,29.21 v11.3,30.35 | U1.53 12.7,31.82 v12.7,31.75
  Bottom 0.152: v11.3,30.35 v12.7,31.75
N$19  (via drill 0.2)
  Top 0.152: U1.60 13.46,36 13.46,36.58 v13.59,36.7
  Bottom 0.152: v13.59,36.7 12.07,35.18 R12.1
N$20  (via drill 0.2)
  Top 0.152: STAT.A 14.19,28.16 v13.97,27.94
  Bottom 0.152: R43.2 14.39,28.36 v13.97,27.94
N$21  (via drill 0.2)
  Top 0.152: U1.62 16.26,34.62 v16.26,34.54
  Bottom 0.152: R43.1 17.12,30.24 17.12,33.68 v16.26,34.54
N$22  (via drill 0.2)
  Top 0.152: U1.61 15.75,34.42 15.75,34.16 v16.51,33.4
  Bottom 0.152: R45.1 16.09,32.98 v16.51,33.4
N$23  (via drill 0.2)
  Top 0.102: U1.5 16.54,43.27 16.54,46.27 16.2,46.62 14.64,46.62 13.93,47.33 CLOCK.3 13.93,48.3 v13.34,48.9
  Bottom 0.102: C17.1 13.86,48.37 v13.34,48.9
N$24
  Top 0.254: B+.1 2.92,64.77 7.2,64.77 PWR.2
N$25
  Top 0.254: U2.6 8.52,56.26 8.52,54.61 C3.1
N$26
  Top 0.254: U2.7 9.26,56.21 9.26,54.61 C3.2
N$27  (via drill 2.1)
  other vias: 2.54,21.59
N$28  (via drill 2.1)
  other vias: 2.54,50.8
N$29  (via drill 2.1)
  other vias: 15.24,50.8
N$30  (via drill 2.1)
  other vias: 15.24,21.59
N$31  (via drill 0.2)
  Top 0.152: v6.35,49.53 6.49,49.4 ACCEL.14
  Bottom 0.152: C5.1 7.06,48.26 6.35,49.41 v6.35,49.53
N$32  (via drill 0.2)
  Top 0.102: U1.35 2.46,35.56 v1.27,35.56 | v1.27,53.34 1.27,54.81 1.94,55.48 1.94,59.59 2.03,59.69 3.48,59.69 3.69,59.48 3.69,58.89 4.02,58.56 USB.2
  Bottom 0.102: v1.27,53.34 1.27,52.58 0.81,52.13 0.81,36.02 v1.27,35.56
N$33  (via drill 0.2)
  Top 0.127: U1.31 1.5,40.89 v1.4,40.89
  Bottom 0.127: C12.1 2.02,41.52 v1.4,40.89
N$34  (via drill 0.2)
  Top 0.127: v6.35,29.21 6.32,29.21 5.5,30.03 5.5,30.67 5.9,31.08 6.46,31.08 U1.47
  Bottom 0.152: C11.1 v6.35,29.21
N$35  (via drill 0.2)
  Top 0.102: U1.36 v1.91,34.3 v1.91,34.29 | v3.81,52.96 4.19,53.33 5.27,53.33 7.17,55.23 7.17,57.62 6.88,57.91 USB.3
  Bottom 0.102: v1.91,34.29 1.93,34.26 2.76,34.26 3.35,34.85 3.35,42.04 3.18,42.22 1.34,42.22 1.2,42.36 1.2,46.53 4.5,49.84 4.5,51.89 3.94,52.46 3.94,52.83 v3.81,52.96
N$36
  Bottom 0.254: U$2.5 4.55,58.73 3.71,57.89 2.14,57.89 R10.1
N$37
  Top 0.152: R13.1 R11.2 4.28,48.13 5.21,48.13 6.35,46.99 6.35,45.97 7.53,44.79 U1.17
N$38
  Bottom 0.254: U$2.3 8.57,56.97 C14.1 8.66,57.04 9.66,58.04 9.66,60.79 11.35,62.48 PWR.3
N$39  (via drill 0.2)
  Top 0.102: U1.6 15.57,43.01 15.57,44.12 v15.49,44.2 15.49,45.34 CLOCK.1
  Bottom 0.102: v15.49,44.2 15.49,45.73 C16.1
N$40
  Bottom 0.102: U$2.1 6.22,58.85 6.22,56.76 6.75,56.23 9.24,56.23 9.46,56.45 9.46,57.19 11.65,59.38 CHRG.A
N$41
  Bottom 0.102: R14.1 13.75,58.92 CHRG.C
N$42
  Top 0.152: U1.14 11.56,44.66 11.56,47.88 11.04,48.4 ACCEL.6
N$50  (via drill 0.2)
  Top 0.15: 13.05,43.89 12.07,44.87 12.07,49.28 13.05,50.26 13.05,51.44
  Top 0.152: 13.05,51.44 13.05,58.33 13,58.37 U$1.S4 | 13.05,43.89 14.11,42.82 14.11,42.27 U1.7 12.49,40.64 10.16,40.64 v8.89,41.91
  Bottom 0.15: R36.1 9.69,38.27 9.84,38.42
  Bottom 0.152: 9.84,38.42 10.16,38.74 RST.2 10.99,39.81 v8.89,41.91 | C37.1 R36.1
N$51  (via drill 0.2)
  Top 0.152: RDY.A 14.19,30.73 13.97,30.51 v13.97,30.48
  Bottom 0.152: R45.2 14.39,30.9 v13.97,30.48
N$71  (via drill 0.2)
  Top 0.152: J1.9 1.56,6.26 v3.05,7.75 3.09,7.75 4.4,9.06 4.4,23.56 2.03,25.93 2.03,33.14 3.87,34.98 U1.38
  Bottom 0.152: R26.1 3.05,5.5 v3.05,7.75
N$93  (via drill 0.2)
  Top 0.152: U$1.S3 12.7,57.37 12.7,50.8 v12.32,50.42 | U1.55 11.69,34.25 11.69,35.69 13.84,37.85 v14.1,37.85
  Bottom 0.15: 12.32,46.99 12.32,45.47 12.95,44.83 13.46,44.83 15.47,42.83
  Bottom 0.152: v14.1,37.85 14.1,38 15.47,39.37 15.47,42.83 | v12.32,50.42 12.32,46.99
V+  (via drill 0.2)
  Top 0.152: v5.08,49.15 3.94,49.15 2.03,47.24 R11.1
  Top 0.254: U2.3 U2.2 | C1.1 7.73,58.79 8.57,59.62 U2.3 | U2.3 8.57,61.92 7.37,63.12 PWR.1
  Bottom 0.152: C13.1 5.08,51.47 v5.08,49.15
  Bottom 0.254: PWR.1 6.35,63.5 7.62,64.77 11.43,64.77 12.7,63.5 12.7,59.31 11.03,57.64 11.03,55.94 D5.1 9.83,55.5 7.16,52.83 C13.1

### Text on the board
tNames: ON | CHRG | PITOT CTRL / DATAQ EULER 2020 / Linus Stöckli